# EasyEDA schematic PCB CREATING.json
TITLE: PCB; REV: 1.0; Date: 2020-05-18; Sheet: 1/1; Company: Your Company
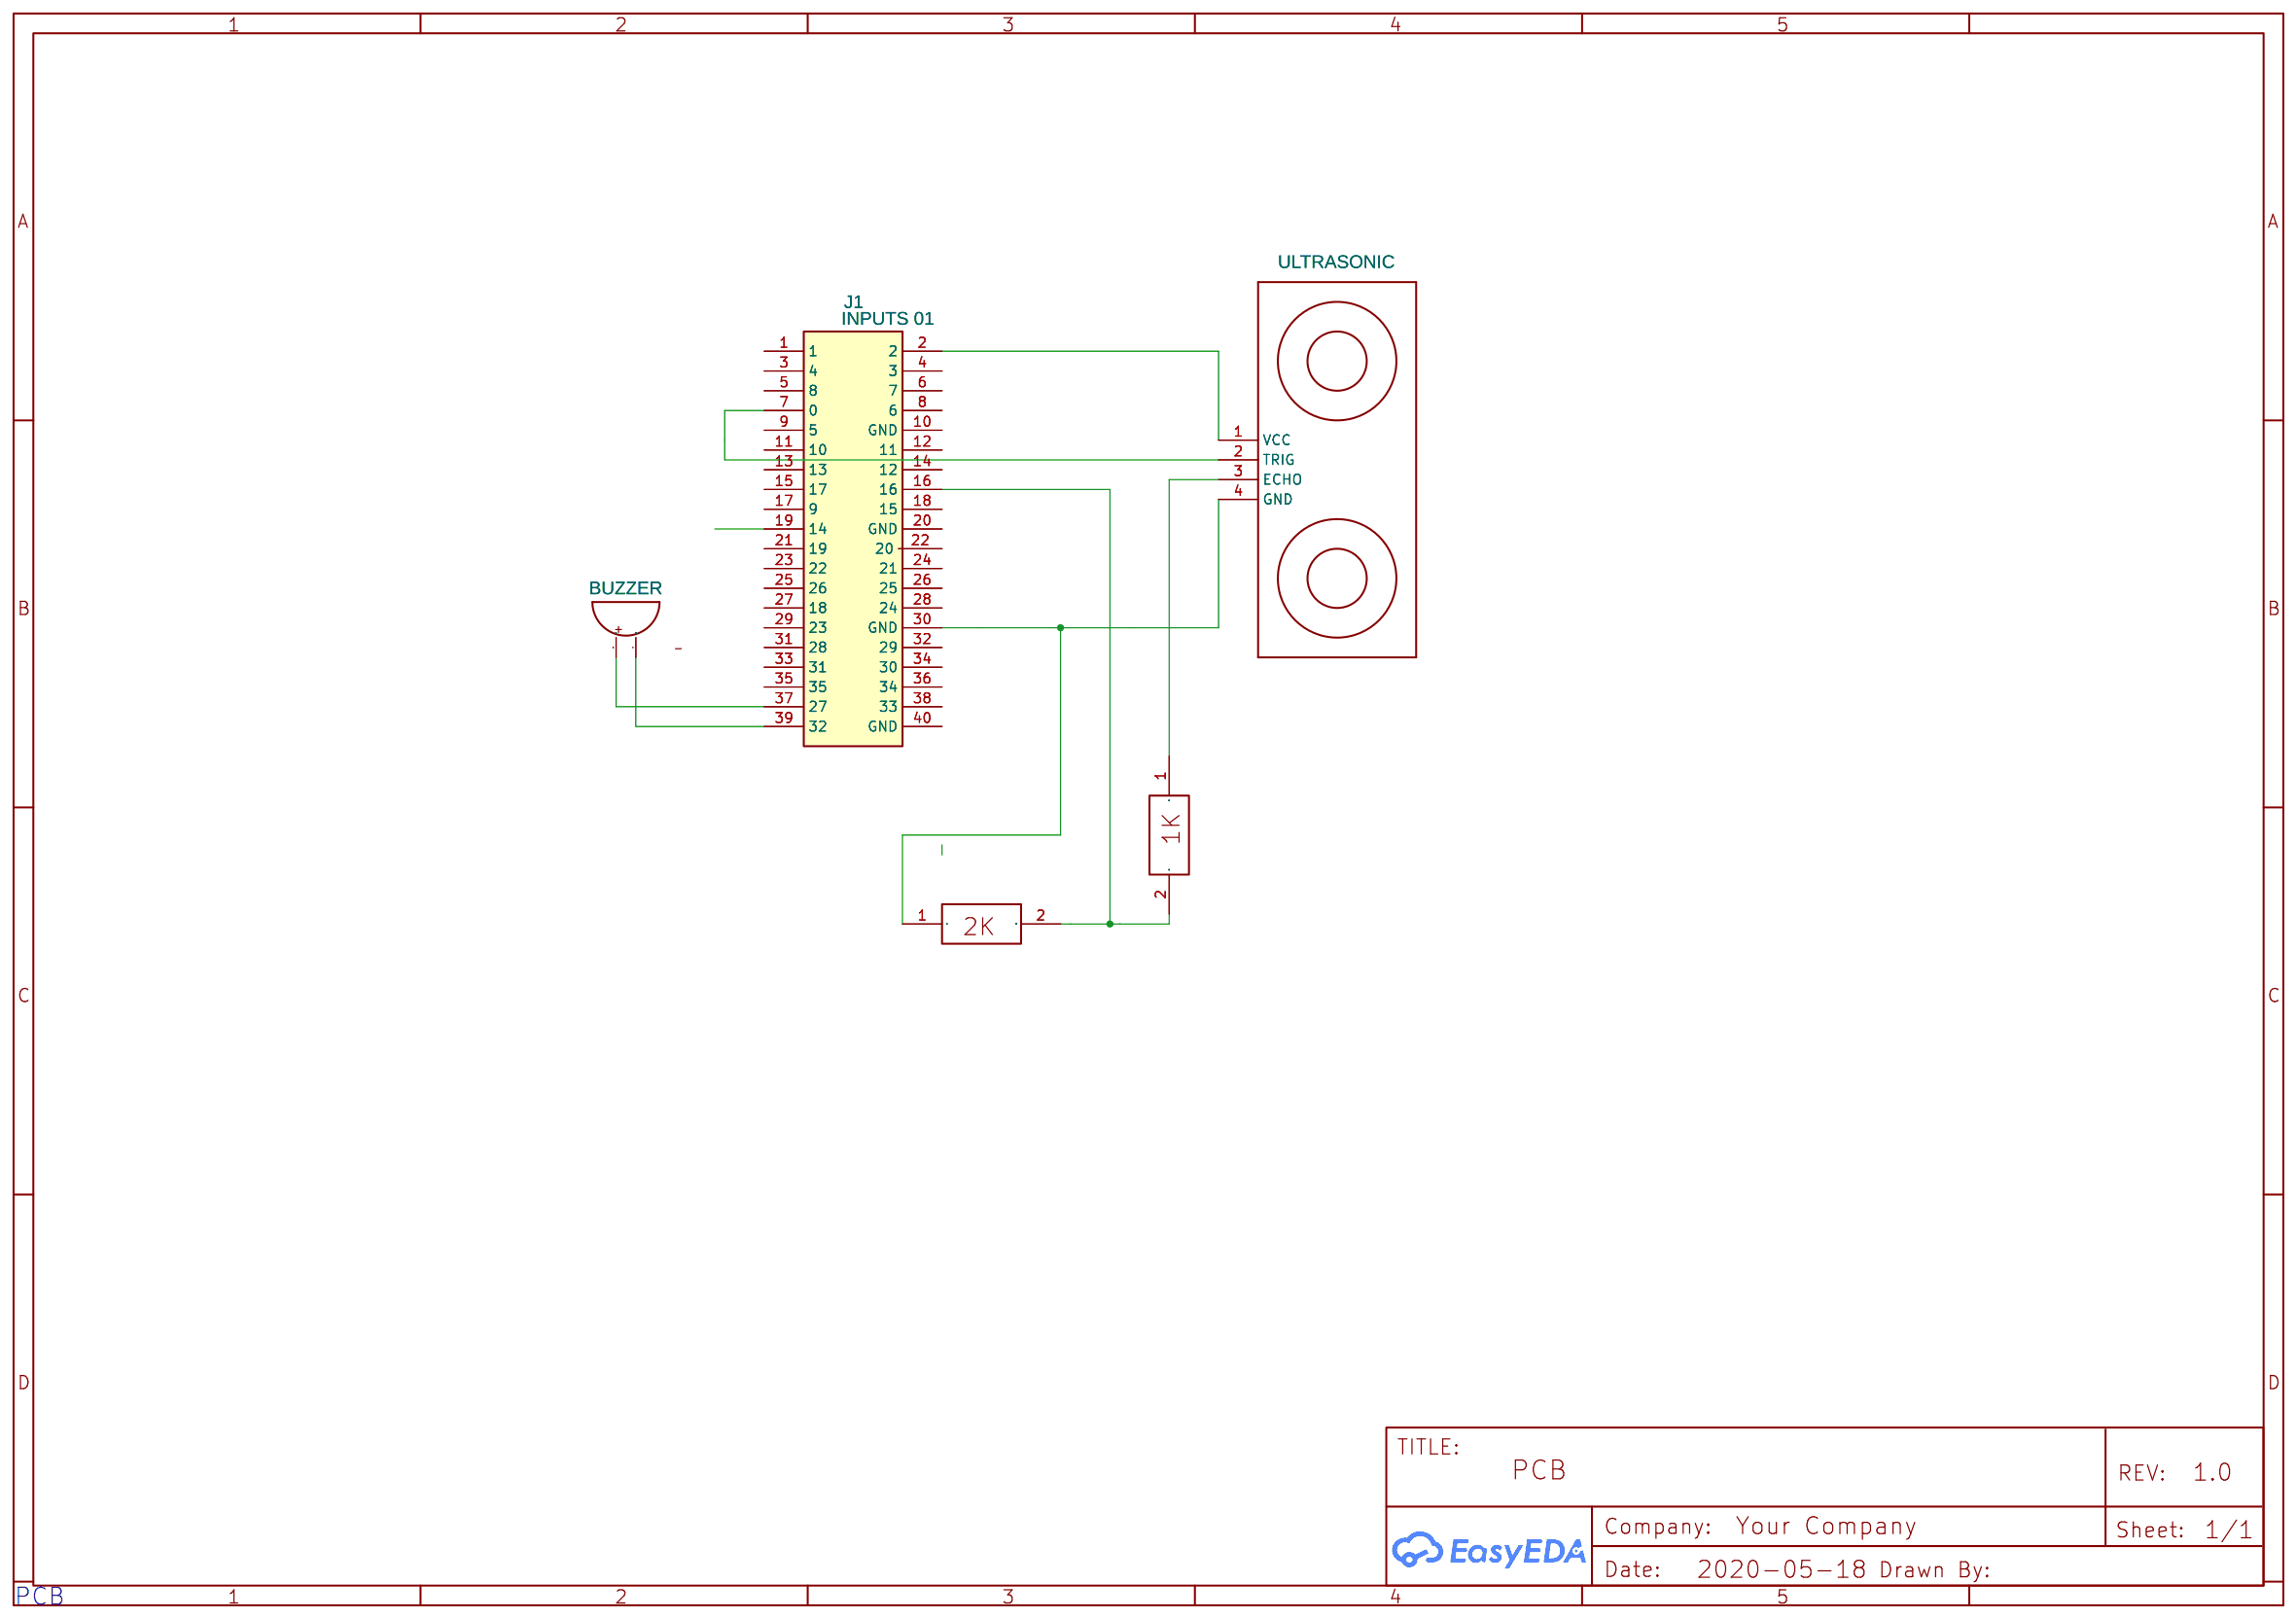
[diagram p0: schematic sheet]

## Parts
J1  INPUTS 01  [HDR-20X2/2.54]
R1  1K resistor  [1K_]
R2  1K resistor  [1K_]
SG1  BUZZER  [BUZZER-12MM-KIT]
U1  ULTRASONIC  [ULTRASONIC-HC-SR04]

## Library data of the parts
J1 = INPUTS 01: EasyEDA: E50982; Supplier Part: C30420; Supplier: LCSC; Manufacturer: EasyEDA; Manufacturer Part: Header-Female-2.54_2x20
R1 R2 = 1K resistor: Contributor: kmrsvishal
SG1 = BUZZER: Contributor: SparkFun
U1 = ULTRASONIC: Ultrasonic Ranging Module HC-SR04; sourceId: iECXHFpLv; Contributor: วริศรา มนตรีมโนรมย์

## Nets
Net-(J1-2): J1.2 U1.1(VCC)
Net-(J1-7): J1.7(0) U1.2(TRIG)
Net-(J1-16): J1.16 R1.2 R2.2
Net-(J1-30): J1.30(GND) R2.1 U1.4(GND)
Net-(J1-37): J1.37(27) SG1.+(1)
Net-(J1-39): J1.39(32) SG1.-(2)
Net-(R1-1): R1.1 U1.3(ECHO)

Not connected (* = marked no-connect by the designer): J1 1 3(4) 4(3) 5(8) 6(7) 8(6) 9(5) 10(GND) 11(10) 12(11) 13 14(12) 15(17) 17(9) 18(15) 19(14) 20(GND) 21(19) 22(20) 23(22) 24(21) 25(26) 26(25) 27(18) 28(24) 29(23) 31(28) 32(29) 33(31) 34(30) 35 36(34) 38(33) 40(GND)

## Notes on the sheet
- PCB
